# EAGLE schematic WideField_V2 (EAGLE 7.3.0)
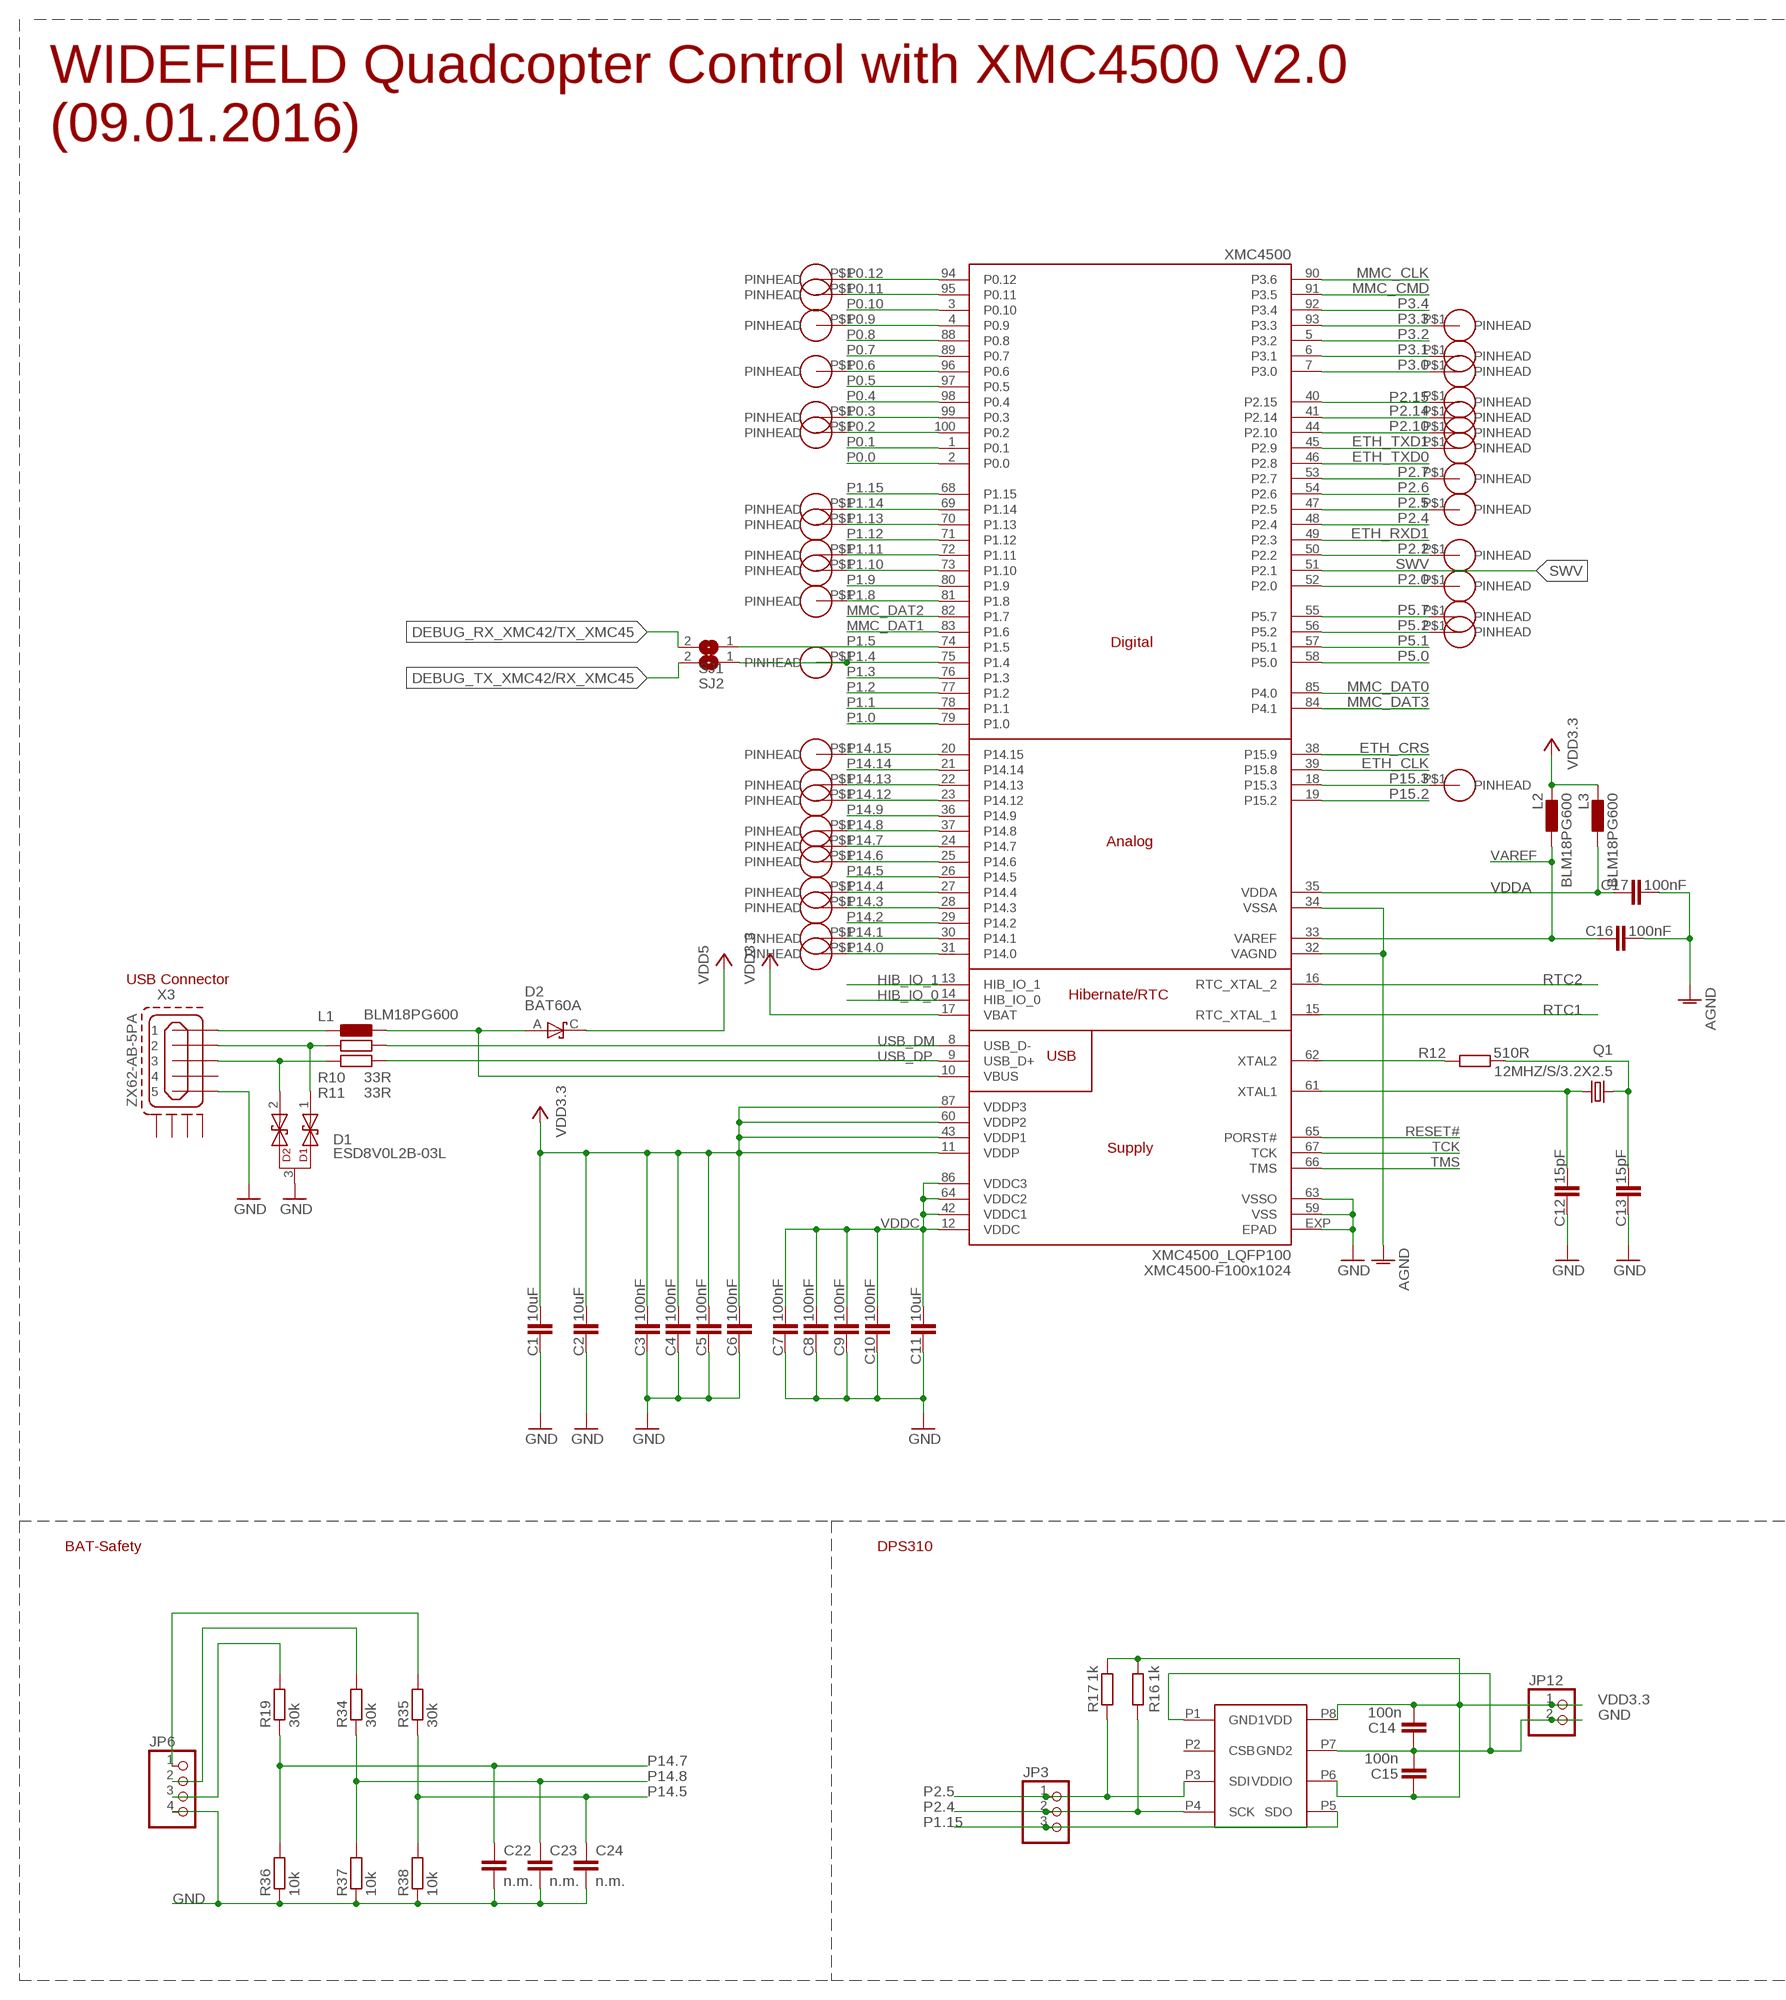
[diagram p0: schematic, sheet 1, part 1 of 2]
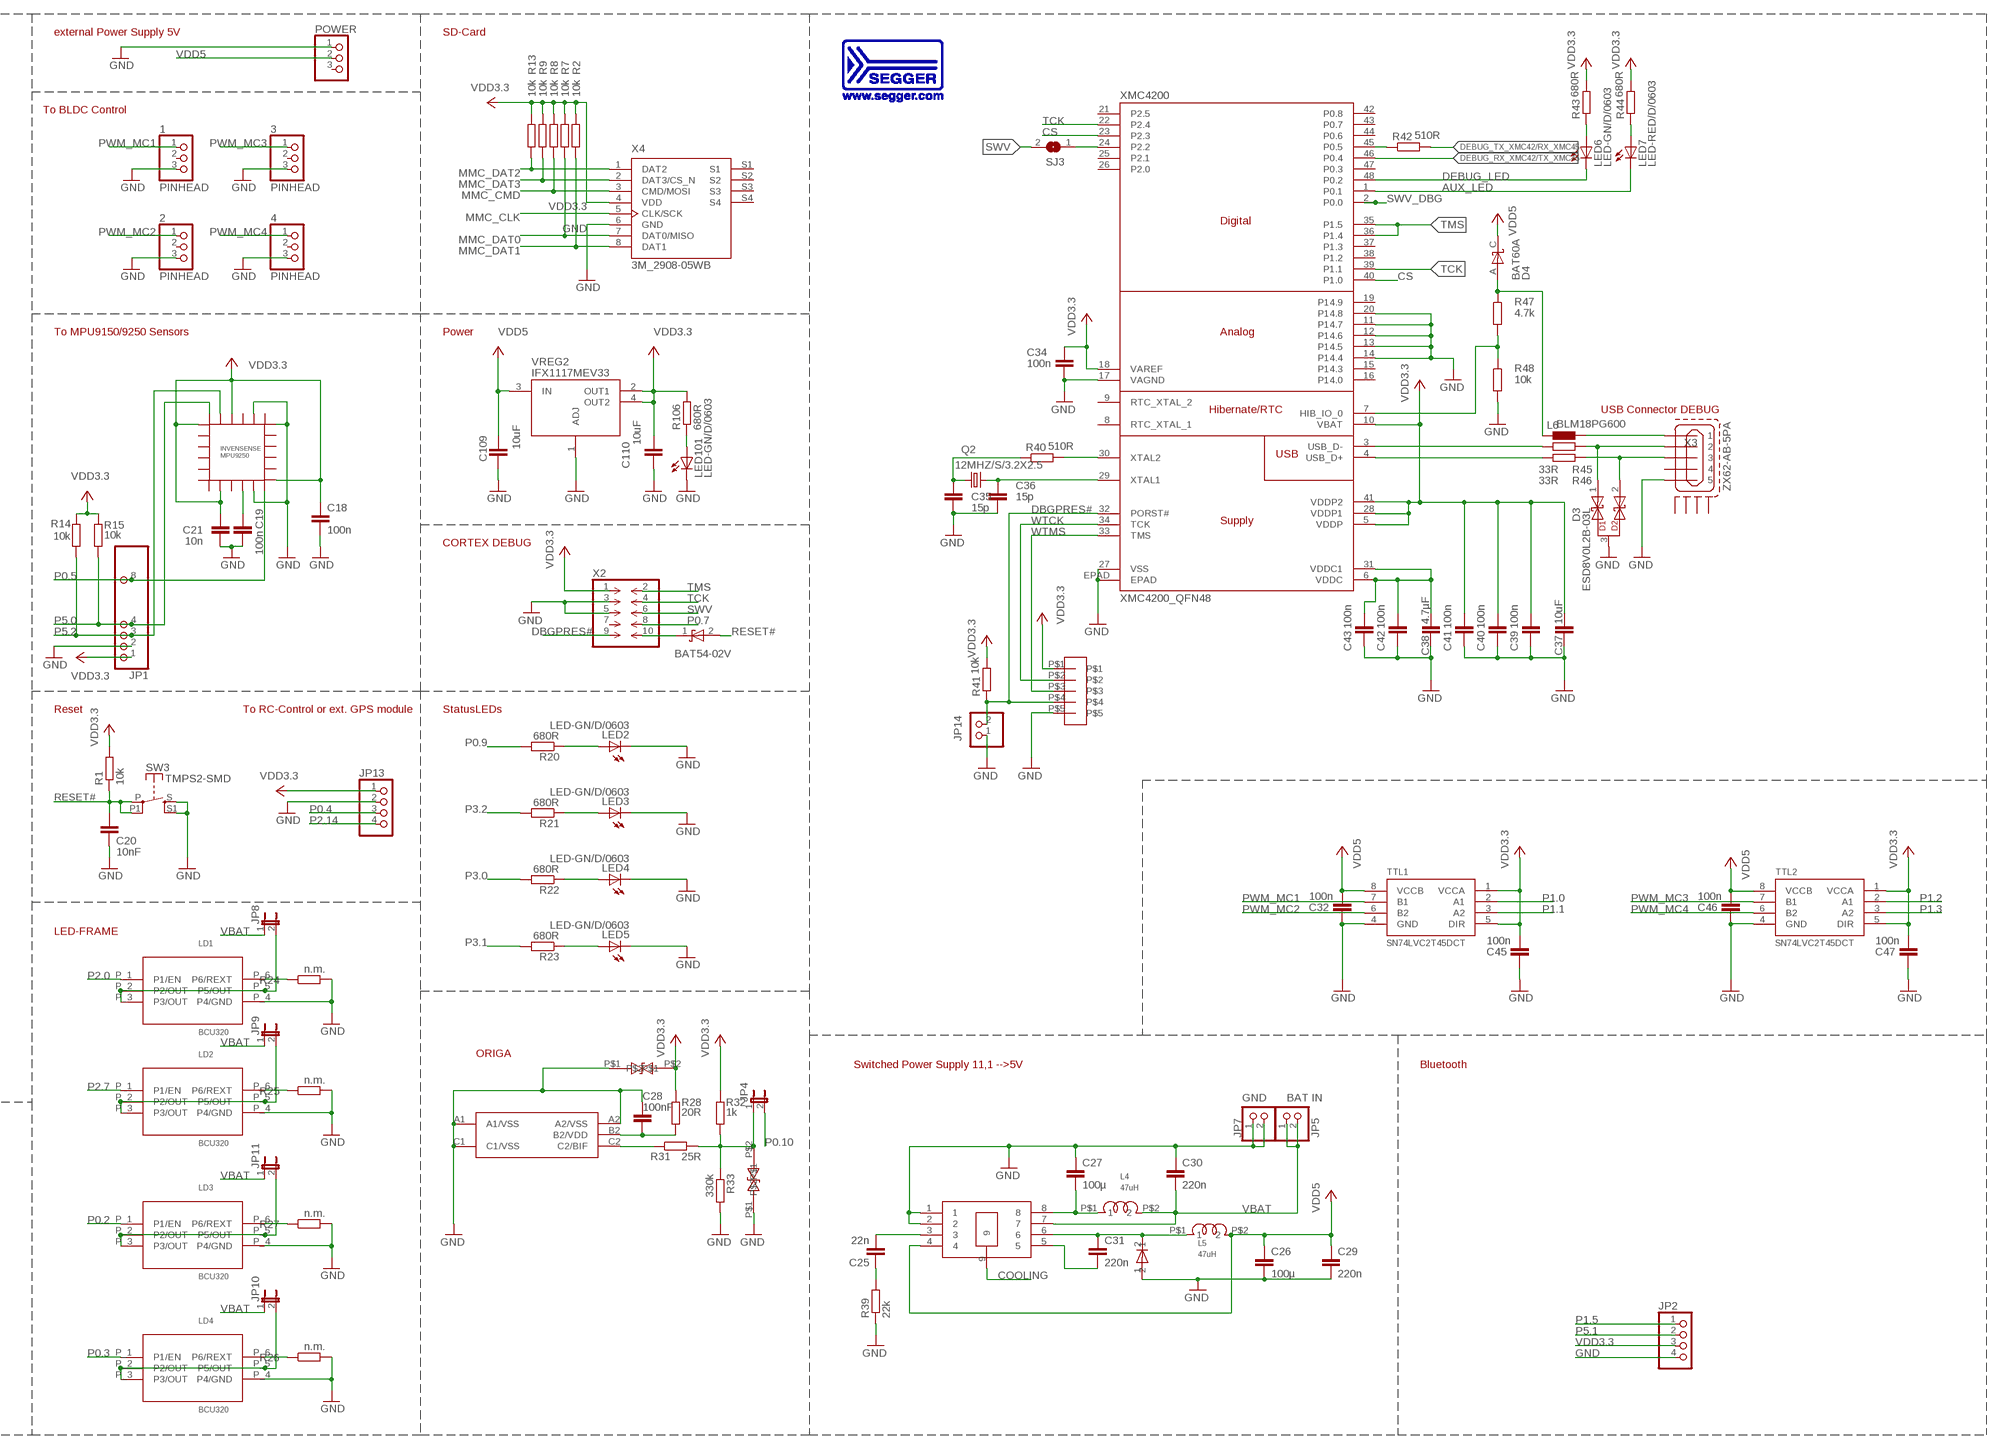
[diagram p1: schematic, sheet 1, part 2 of 2]

## Parts
1  PINHEAD  PINHD-1X3  [1X03]
2  PINHEAD  PINHD-1X3  [1X03]
3  PINHEAD  PINHD-1X3  [1X03]
4  PINHEAD  PINHD-1X3  [1X03]
C1  10uF  C-EUC0805K  [C0805K]
C2  10uF  C-EUC0805K  [C0805K]
C3  100nF  C-EUC0402  [C0402]
C4  100nF  C-EUC0402  [C0402]
C5  100nF  C-EUC0402  [C0402]
C6  100nF  C-EUC0402  [C0402]
C7  100nF  C-EUC0402  [C0402]
C8  100nF  C-EUC0402  [C0402]
C9  100nF  C-EUC0402  [C0402]
C10  100nF  C-EUC0402  [C0402]
C11  10uF  C-EUC0805K  [C0805K]
C12  15pF  C-EUC0402  [C0402]
C13  15pF  C-EUC0402  [C0402]
C14  100n  C-EUC0603  [C0603]
C15  100n  C-EUC0603  [C0603]
C16  100nF  C-EUC0402  [C0402]
C17  100nF  C-EUC0402  [C0402]
C18  100n  C-EUC0603  [C0603]
C19  100n  C-EUC0603  [C0603]
C20  10nF  C-EUC0603  [C0603]
C21  10n  C-EUC0603  [C0603]
C22  n.m.  C-EUC0603K  [C0603K]
C23  n.m.  C-EUC0603K  [C0603K]
C24  n.m.  C-EUC0603K  [C0603K]
C25  22n  C-EUC0603  [C0603]
C26  100µ  C-EUC1210K  [C1210K]
C27  100µ  C-EUC1210K  [C1210K]
C28  100nF  C-EUC0603  [C0603]
C29  220n  C-EUC0603K  [C0603K]
C30  220n  C-EUC0603K  [C0603K]
C31  220n  C-EUC0603K  [C0603K]
C32  100n  C-EUC0603  [C0603]
C34  100n  C-EUC0402  [C0402]
C35  15p  C-EUC0402  [C0402]
C36  15p  C-EUC0402  [C0402]
C37  10uF  C-EUC0805K  [C0805K]
C38  4.7µF  C-EUC0805K  [C0805K]
C39  100n  C-EUC0402  [C0402]
C40  100n  C-EUC0402  [C0402]
C41  100n  C-EUC0402  [C0402]
C42  100n  C-EUC0402  [C0402]
C43  100n  C-EUC0402  [C0402]
C45  100n  C-EUC0603  [C0603]
C46  100n  C-EUC0603  [C0603]
C47  100n  C-EUC0603  [C0603]
C109  10uF  C-EUC0805K  [C0805K]
C110  10uF  C-EUC0805K  [C0805K]
D1  ESD8V0L2B-03L  [TSLP-3-1]
D2  BAT60A  BAT60  [SOD323-R]
D3  ESD8V0L2B-03L  [TSLP-3-1]
D4  BAT60A  BAT60  [SOD323-R]
D5  INF-SOD323_V_1  [INF-SOD323_V_1PRIMARY]
D6  ESD218-B1-02EL  [TSLP-2-20]
D7  ESD218-B1-02EL  [TSLP-2-20]
D8  BAT54-02V  [SC79]
DPS310  DPS310  DPS310DRUCKSENSOR  [LGA8R125P0X4_500X300X120]
JP1  PINHD-1X10  [1X10]
JP2  PINHD-1X4  [1X04]
JP3  PINHD-1X3  [1X03]
JP4  JP1E  [JP1]
JP5  PINHD-1X2  [1X02]
JP6  PINHD-1X4  [1X04]
JP7  PINHD-1X2  [1X02]
JP8  JP1E  [JP1]
JP9  JP1E  [JP1]
JP10  JP1E  [JP1]
JP11  JP1E  [JP1]
JP12  PINHD-1X2  [1X02]
JP13  PINHD-1X4  [1X04]
JP14  PINHD-1X2  [1X02]
L1  BLM18PG600  L_EU_L0603  [L1608]
L2  BLM18PG600  L_EU_L0603  [L1608]
L3  BLM18PG600  L_EU_L0603  [L1608]
L4  47uH  WUERTH47UHIND  [WE-TPC]
L5  47uH  WUERTH47UHIND  [WE-TPC]
L6  BLM18PG600  L_EU_L0603  [L1608]
LD1  BCU320  [SC74]
LD2  BCU320  [SC74]
LD3  BCU320  [SC74]
LD4  BCU320  [SC74]
LED2  LED-GN/D/0603  LEDCHIPLED_0603  [CHIPLED_0603]
LED3  LED-GN/D/0603  LEDCHIPLED_0603  [CHIPLED_0603]
LED4  LED-GN/D/0603  LEDCHIPLED_0603  [CHIPLED_0603]
LED5  LED-GN/D/0603  LEDCHIPLED_0603  [CHIPLED_0603]
LED6  LED-GN/D/0603  LEDCHIPLED_0603  [CHIPLED_0603]
LED7  LED-RED/D/0603  LEDCHIPLED_0603  [CHIPLED_0603]
LED101  LED-GN/D/0603  LEDCHIPLED_0603  [CHIPLED_0603]
MPU9250  9250  INVENSENSE9250IHERBY  [QFN3X3-24+]
ORIGA  n.m.  ORIGA2L  [WLB-5]
POWER  PINHD-1X3  [1X03]
Q1  12MHZ/S/3.2X2.5  NX3225_2  [32X25_4PAD]
Q2  12MHZ/S/3.2X2.5  NX3225_2  [32X25_4PAD]
R1  10k  R-EU_R0603  [R0603]
R2  10k  R-EU_R0402  [R0402]
R7  10k  R-EU_R0402  [R0402]
R8  10k  R-EU_R0402  [R0402]
R9  10k  R-EU_R0402  [R0402]
R10  33R  R-EU_R0402  [R0402]
R11  33R  R-EU_R0402  [R0402]
R12  510R  R-EU_R0603  [R0603]
R13  10k  R-EU_R0402  [R0402]
R14  10k  R-EU_R0603  [R0603]
R15  10k  R-EU_R0603  [R0603]
R16  1k  R-EU_R0603  [R0603]
R17  1k  R-EU_R0603  [R0603]
R19  30k  R-EU_R0603  [R0603]
R20  680R  R-EU_R0603  [R0603]
R21  680R  R-EU_R0603  [R0603]
R22  680R  R-EU_R0603  [R0603]
R23  680R  R-EU_R0603  [R0603]
R24  n.m.  R-EU_R0603  [R0603]
R25  n.m.  R-EU_R0603  [R0603]
R26  n.m.  R-EU_R0603  [R0603]
R27  n.m.  R-EU_R0603  [R0603]
R28  20R  R-EU_R0603  [R0603]
R31  25R  R-EU_R0603  [R0603]
R32  1k  R-EU_R0603  [R0603]
R33  330k  R-EU_R0603  [R0603]
R34  30k  R-EU_R0603  [R0603]
R35  30k  R-EU_R0603  [R0603]
R36  10k  R-EU_R0603  [R0603]
R37  10k  R-EU_R0603  [R0603]
R38  10k  R-EU_R0603  [R0603]
R39  22k  R-EU_R0603  [R0603]
R40  510R  R-EU_R0402  [R0402]
R41  10k  R-EU_R0402  [R0402]
R42  510R  R-EU_R0402  [R0402]
R43  680R  R-EU_R0402  [R0402]
R44  680R  R-EU_R0402  [R0402]
R45  33R  R-EU_R0402  [R0402]
R46  33R  R-EU_R0402  [R0402]
R47  4.7k  R-EU_R0402  [R0402]
R48  10k  R-EU_R0402  [R0402]
R106  680R  R-EU_R0603  [R0603]
SJ1  SJ  [SJ]
SJ2  SJ  [SJ]
SJ3  SJ  [SJ]
SW3  TMPS2-SMD  FSM2JSMA  [FSM2JSMA]
TTL1  SN74LVC2T45DCT  [DCT_R-PDSO-G8]
TTL2  SN74LVC2T45DCT  [DCT_R-PDSO-G8]
U$4  SEGGER.L_100  [LOGO_100]
U$6  PINHEADSMALL1  [PINHEADER_SMALL1]
U$7  PINHEADSMALL1  [PINHEADER_SMALL1]
U$10  PINHEADSMALL1  [PINHEADER_SMALL1]
U$12  n.m.  127MARKED  [PINHEAD_127]
U$25  PINHEADSMALL1  [PINHEADER_SMALL1]
U$26  PINHEADSMALL1  [PINHEADER_SMALL1]
U$27  PINHEADSMALL1  [PINHEADER_SMALL1]
U$28  PINHEADSMALL1  [PINHEADER_SMALL1]
U$29  PINHEADSMALL1  [PINHEADER_SMALL1]
U$30  PINHEADSMALL1  [PINHEADER_SMALL1]
U$31  PINHEADSMALL1  [PINHEADER_SMALL1]
U$35  PINHEADSMALL1  [PINHEADER_SMALL1]
U$36  PINHEADSMALL1  [PINHEADER_SMALL1]
U$37  PINHEADSMALL1  [PINHEADER_SMALL1]
U$38  PINHEADSMALL1  [PINHEADER_SMALL1]
U$40  PINHEADSMALL1  [PINHEADER_SMALL1]
U$41  PINHEADSMALL1  [PINHEADER_SMALL1]
U$42  PINHEADSMALL1  [PINHEADER_SMALL1]
U$44  PINHEADSMALL1  [PINHEADER_SMALL1]
U$45  PINHEADSMALL1  [PINHEADER_SMALL1]
U$47  PINHEADSMALL1  [PINHEADER_SMALL1]
U$48  PINHEADSMALL1  [PINHEADER_SMALL1]
U$49  PINHEADSMALL1  [PINHEADER_SMALL1]
U$52  PINHEADSMALL1  [PINHEADER_SMALL1]
U$53  PINHEADSMALL1  [PINHEADER_SMALL1]
U$55  PINHEADSMALL1  [PINHEADER_SMALL1]
U$57  PINHEADSMALL1  [PINHEADER_SMALL1]
U$59  PINHEADSMALL1  [PINHEADER_SMALL1]
U$60  PINHEADSMALL1  [PINHEADER_SMALL1]
U$62  PINHEADSMALL1  [PINHEADER_SMALL1]
U$63  PINHEADSMALL1  [PINHEADER_SMALL1]
U$65  PINHEADSMALL1  [PINHEADER_SMALL1]
U$67  PINHEADSMALL1  [PINHEADER_SMALL1]
U$68  PINHEADSMALL1  [PINHEADER_SMALL1]
U$71  PINHEADSMALL1  [PINHEADER_SMALL1]
U$74  PINHEADSMALL1  [PINHEADER_SMALL1]
U$76  PINHEADSMALL1  [PINHEADER_SMALL1]
USB1  ZX62-AB-5PA  ZX62-AB-5PA_MICRO-USB  [ZX62-AB-5PA_MICRO-USB]
USB2  ZX62-AB-5PA  ZX62-AB-5PA_MICRO-USB  [ZX62-AB-5PA_MICRO-USB]
VREG1  IFX-91041-V50  INF-PG-DSO-8-27_N_1  [INF-PG-DSO-8-27_N_1PRIMARY]
VREG2  IFX1117MEV33  IFX1117  [SOT223]
X2  FTSH-105-01-F-D-K  [FTSH-105-01-F-D-K]
X4  3M_2908-05WB  [3M_MICRO-SD_SLOT]
XMC4200  XMC4200_QFN48  [QFN-48-7X7]
XMC4500  XMC4500_LQFP100  XMC4400_LQFP100  [P/PG-LQFP-100-11]

## Nets
AGND: C16.2 C17.2 XMC4500.32(VAGND) XMC4500.34(VSSA)
AUX_LED: LED7.C XMC4200.1(P0.1)
COOLING: VREG1.9
CS: XMC4200.23(P2.3) XMC4200.40(P1.0)
DBGPRES#: JP14.2 R41.1 U$12.P$4 X2.9 XMC4200.32(PORST#)
DEBUG_LED: LED6.C XMC4200.48(P0.2)
DEBUG_RX_XMC42/TX_XMC45: SJ1.2 XMC4200.46(P0.4)
DEBUG_TX_XMC42/RX_XMC45: R42.2 SJ2.2
ETH_CLK: XMC4500.39(P15.8)
ETH_CRS: XMC4500.38(P15.9)
ETH_RXD1: XMC4500.49(P2.3)
ETH_TXD0: XMC4500.46(P2.8)
ETH_TXD1: U$30.P$1(PINHEAD) XMC4500.45(P2.9)
GND: 1.3 2.3 3.3 4.3 C1.2 C2.2 C3.2 C4.2 C5.2 C6.2 C7.2 C8.2 C9.2 C10.2 C11.2 C12.2 C13.2 C14.2 C15.1 C18.2 C19.1 C20.2 C21.1 C22.2 C23.2 C24.2 C26.2 C27.1 C28.1 C29.2 C30.1 C32.2 C34.2 C35.2 C36.2 C37.2 C38.2 C39.2 C40.2 C41.2 C42.2 C43.2 C45.2 C46.2 C47.2 C109.2 C110.2 D1.3 D3.3 D5.1 D6.P$1 D7.P$1 DPS310.P1(GND1) DPS310.P7(GND2) JP1.2 JP2.4 JP6.4 JP7.1 JP7.2 JP12.2 JP13.2 JP14.1 LD1.P_4(P4/GND) LD2.P_4(P4/GND) LD3.P_4(P4/GND) LD4.P_4(P4/GND) LED2.C LED3.C LED4.C LED5.C LED101.C MPU9250.11 MPU9250.18 MPU9250.20 ORIGA.A1(A1/VSS) ORIGA.A2(A2/VSS) ORIGA.C1(C1/VSS) POWER.1 R24.2 R25.2 R26.2 R27.2 R33.2 R36.1 R37.1 R38.1 R39.1 R48.2 SW3.S SW3.S1(S) TTL1.4(GND) TTL2.4(GND) U$12.P$5 USB1.5 USB2.5 VREG1.1 VREG1.2 VREG2.1(ADJ) X2.3 X2.5 X4.6(GND) XMC4200.11(P14.7) XMC4200.12(P14.6) XMC4200.13(P14.5) XMC4200.14(P14.4) XMC4200.17(VAGND) XMC4200.20(P14.8) XMC4200.27(VSS) XMC4200.EPAD XMC4500.59(VSS) XMC4500.63(VSSO) XMC4500.EXP(EPAD)
HIB_IO_0: XMC4500.14(HIB_IO_0)
HIB_IO_1: XMC4500.13(HIB_IO_1)
MMC_CLK: X4.5(CLK/SCK) XMC4500.90(P3.6)
MMC_CMD: R8.1 X4.3(CMD/MOSI) XMC4500.91(P3.5)
MMC_DAT0: R7.1 X4.7(DAT0/MISO) XMC4500.85(P4.0)
MMC_DAT1: R2.1 X4.8(DAT1) XMC4500.83(P1.6)
MMC_DAT2: R13.1 X4.1(DAT2) XMC4500.82(P1.7)
MMC_DAT3: R9.1 X4.2(DAT3/CS_N) XMC4500.84(P4.1)
N$1: LED2.A R20.1
N$2: C38.1 C42.1 C43.1 XMC4200.6(VDDC) XMC4200.31(VDDC1)
N$3: LED3.A R21.1
N$4: LED6.A R43.1
N$5: LED7.A R44.1
N$6: R12.1 XMC4500.62(XTAL2)
N$7: C13.1 Q1.3 R12.2
N$8: C12.1 Q1.1 XMC4500.61(XTAL1)
N$9: JP6.1 R35.2
N$10: C35.1 Q2.1 R40.1
N$11: L1.2 USB1.1
N$12: C25.2 VREG1.3
N$13: D1.1 R10.1 USB1.2
N$15: C25.1 R39.2
N$16: LED101.A R106.1
N$17: C27.2 L4.P$1 VREG1.8
N$19: C28.2 ORIGA.B2(B2/VDD) R28.2
N$21: JP6.2 R34.2
N$22: LED4.A R22.1
N$23: D2.A L1.1 XMC4500.10(VBUS)
N$24: LED5.A R23.1
N$25: ORIGA.C2(C2/BIF) R31.1
N$26: LD1.P_6(P6/REXT) R24.1
N$27: D6.P$2 JP4.1 R31.2 R32.2 R33.1
N$28: JP8.2 LD1.P_2(P2/OUT) LD1.P_3(P3/OUT) LD1.P_5(P5/OUT)
N$29: LD2.P_6(P6/REXT) R25.1
N$30: JP9.2 LD2.P_2(P2/OUT) LD2.P_3(P3/OUT) LD2.P_5(P5/OUT)
N$31: LD4.P_6(P6/REXT) R26.1
N$32: JP10.2 LD4.P_2(P2/OUT) LD4.P_3(P3/OUT) LD4.P_5(P5/OUT)
N$33: LD3.P_6(P6/REXT) R27.1
N$34: JP11.2 LD3.P_2(P2/OUT) LD3.P_3(P3/OUT) LD3.P_5(P5/OUT)
N$35: JP6.3 R19.2
N$36: D1.2 R11.1 USB1.3
N$37: C31.2 VREG1.5
N$38: L6.2 USB2.1
N$39: C31.1 D5.2 L5.P$1 VREG1.6
N$40: R40.2 XMC4200.30(XTAL2)
N$41: C36.1 Q2.3 XMC4200.29(XTAL1)
N$42: C19.2 MPU9250.10
N$44: D8.1(C) X2.10
N$47: D3.1 R45.1 USB2.2
N$48: D3.2 R46.1 USB2.3
N$49: D4.A L6.1 R47.1
N$50: R42.1 XMC4200.45(P0.5)
N$52: R47.2 R48.1 XMC4200.7(HIB_IO_0)
P0.0: XMC4500.2(P0.0)
P0.1: XMC4500.1(P0.1)
P0.2: LD3.P_1(P1/EN) U$67.P$1(PINHEAD) XMC4500.100(P0.2)
P0.3: LD4.P_1(P1/EN) U$68.P$1(PINHEAD) XMC4500.99(P0.3)
P0.4: JP13.3 XMC4500.98(P0.4)
P0.5: JP1.8 MPU9250.12 XMC4500.97(P0.5)
P0.6: U$71.P$1(PINHEAD) XMC4500.96(P0.6)
P0.7: X2.8 XMC4500.89(P0.7)
P0.8: XMC4500.88(P0.8)
P0.9: R20.2 U$74.P$1(PINHEAD) XMC4500.4(P0.9)
P0.10: JP4.2 XMC4500.3(P0.10)
P0.11: U$76.P$1(PINHEAD) XMC4500.95(P0.11)
P0.12: U$7.P$1(PINHEAD) XMC4500.94(P0.12)
P1.0: TTL1.2(A1) XMC4500.79(P1.0)
P1.1: TTL1.3(A2) XMC4500.78(P1.1)
P1.2: TTL2.2(A1) XMC4500.77(P1.2)
P1.3: TTL2.3(A2) XMC4500.76(P1.3)
P1.4: SJ2.1 U$40.P$1(PINHEAD) XMC4500.75(P1.4)
P1.5: JP2.1 SJ1.1 XMC4500.74(P1.5)
P1.8: U$57.P$1(PINHEAD) XMC4500.81(P1.8)
P1.9: XMC4500.80(P1.9)
P1.10: U$59.P$1(PINHEAD) XMC4500.73(P1.10)
P1.11: U$60.P$1(PINHEAD) XMC4500.72(P1.11)
P1.12: XMC4500.71(P1.12)
P1.13: U$62.P$1(PINHEAD) XMC4500.70(P1.13)
P1.14: U$63.P$1(PINHEAD) XMC4500.69(P1.14)
P1.15: DPS310.P5(SDO) JP3.3 XMC4500.68(P1.15)
P2.0: LD1.P_1(P1/EN) U$35.P$1(PINHEAD) XMC4500.52(P2.0)
P2.2: U$65.P$1(PINHEAD) XMC4500.50(P2.2)
P2.4: DPS310.P4(SCK) JP3.2 R16.2 XMC4500.48(P2.4)
P2.5: DPS310.P3(SDI) JP3.1 R17.2 U$31.P$1(PINHEAD) XMC4500.47(P2.5)
P2.6: XMC4500.54(P2.6)
P2.7: LD2.P_1(P1/EN) U$29.P$1(PINHEAD) XMC4500.53(P2.7)
P2.10: U$28.P$1(PINHEAD) XMC4500.44(P2.10)
P2.14: JP13.4 U$27.P$1(PINHEAD) XMC4500.41(P2.14)
P2.15: U$26.P$1(PINHEAD) XMC4500.40(P2.15)
P3.0: R22.2 U$25.P$1(PINHEAD) XMC4500.7(P3.0)
P3.1: R23.2 U$10.P$1(PINHEAD) XMC4500.6(P3.1)
P3.2: R21.2 XMC4500.5(P3.2)
P3.3: U$6.P$1(PINHEAD) XMC4500.93(P3.3)
P3.4: XMC4500.92(P3.4)
P5.0: JP1.4 MPU9250.24 R15.1 XMC4500.58(P5.0)
P5.1: JP2.2 XMC4500.57(P5.1)
P5.2: JP1.3 MPU9250.23 R14.1 U$37.P$1(PINHEAD) XMC4500.56(P5.2)
P5.7: U$36.P$1(PINHEAD) XMC4500.55(P5.7)
P14.0: U$41.P$1(PINHEAD) XMC4500.31(P14.0)
P14.1: U$42.P$1(PINHEAD) XMC4500.30(P14.1)
P14.2: XMC4500.29(P14.2)
P14.3: U$44.P$1(PINHEAD) XMC4500.28(P14.3)
P14.4: U$45.P$1(PINHEAD) XMC4500.27(P14.4)
P14.5: C24.1 R35.1 R38.2 XMC4500.26(P14.5)
P14.6: U$47.P$1(PINHEAD) XMC4500.25(P14.6)
P14.7: C22.1 R19.1 R36.2 U$48.P$1(PINHEAD) XMC4500.24(P14.7)
P14.8: C23.1 R34.1 R37.2 U$49.P$1(PINHEAD) XMC4500.37(P14.8)
P14.9: XMC4500.36(P14.9)
P14.12: U$52.P$1(PINHEAD) XMC4500.23(P14.12)
P14.13: U$53.P$1(PINHEAD) XMC4500.22(P14.13)
P14.14: XMC4500.21(P14.14)
P14.15: U$55.P$1(PINHEAD) XMC4500.20(P14.15)
P15.2: XMC4500.19(P15.2)
P15.3: U$38.P$1(PINHEAD) XMC4500.18(P15.3)
PWM_MC1: 1.1 TTL1.7(B1)
PWM_MC2: 2.1 TTL1.6(B2)
PWM_MC3: 3.1 TTL2.7(B1)
PWM_MC4: 4.1 TTL2.6(B2)
RESET#: C20.1 D8.2(A) R1.1 SW3.P SW3.P1(P) XMC4500.65(PORST#)
RTC1: XMC4500.15(RTC_XTAL_1)
RTC2: XMC4500.16(RTC_XTAL_2)
SWV: SJ3.2 X2.6 XMC4500.51(P2.1)
SWV_DBG: SJ3.1 XMC4200.2(P0.0) XMC4200.24(P2.2)
TCK: X2.4 XMC4200.22(P2.4) XMC4200.39(P1.1) XMC4500.67(TCK)
TMS: X2.2 XMC4200.35(P1.5) XMC4200.36(P1.4) XMC4500.66(TMS)
USB_DM: R10.2 XMC4500.8(USB_D-)
USB_DM1: R45.2 XMC4200.3(USB_D-)
USB_DP: R11.2 XMC4500.9(USB_D+)
USB_DP1: R46.2 XMC4200.4(USB_D+)
VAREF: C16.1 L2.1 XMC4500.33(VAREF)
VBAT: C30.2 JP5.1 JP5.2 JP8.1 JP9.1 JP10.1 JP11.1 L4.P$2 VREG1.7
VDD3.3: C1.1 C2.1 C3.1 C4.1 C5.1 C6.1 C14.1 C15.2 C18.1 C21.2 C34.1 C37.1 C39.1 C40.1 C41.1 C45.1 C47.1 C110.1 D7.P$2 DPS310.P6(VDDIO) DPS310.P8(VDD) JP1.1 JP2.3 JP12.1 JP13.1 L2.2 L3.2 MPU9250.1 MPU9250.8 MPU9250.13 MPU9250.22 R1.2 R2.2 R7.2 R8.2 R9.2 R13.2 R14.2 R15.2 R16.1 R17.1 R28.1 R32.1 R41.2 R43.2 R44.2 R106.2 TTL1.1(VCCA) TTL1.5(DIR) TTL2.1(VCCA) TTL2.5(DIR) U$12.P$1 VREG2.2(OUT1) VREG2.4(OUT2) X2.1 X4.4(VDD) XMC4200.5(VDDP) XMC4200.10(VBAT) XMC4200.18(VAREF) XMC4200.28(VDDP1) XMC4200.41(VDDP2) XMC4500.11(VDDP) XMC4500.17(VBAT) XMC4500.43(VDDP1) XMC4500.60(VDDP2) XMC4500.87(VDDP3)
VDD5: C26.1 C29.1 C32.1 C46.1 C109.1 D2.C D4.C L5.P$2 POWER.2 TTL1.8(VCCB) TTL2.8(VCCB) VREG1.4 VREG2.3(IN)
VDDA: C17.1 L3.1 XMC4500.35(VDDA)
VDDC: C7.1 C8.1 C9.1 C10.1 C11.1 XMC4500.12(VDDC) XMC4500.42(VDDC1) XMC4500.64(VDDC2) XMC4500.86(VDDC3)
WTCK: U$12.P$2 XMC4200.34(TCK)
WTMS: U$12.P$3 XMC4200.33(TMS)
Unconnected: 1.2 2.2 3.2 4.2 DPS310.P2(CSB) MPU9250.2 MPU9250.3 MPU9250.4 MPU9250.5 MPU9250.6 MPU9250.7 MPU9250.9 MPU9250.14 MPU9250.15 MPU9250.16 MPU9250.17 MPU9250.19 MPU9250.21 POWER.3 USB1.4 USB1.S1(S:S1) USB1.S2(S:S2) USB1.S3(S:S3) USB1.S4(S:S4) USB2.4 USB2.S1(S:S1) USB2.S2(S:S2) USB2.S3(S:S3) USB2.S4(S:S4) X2.7 X4.S1 X4.S2 X4.S3 X4.S4 XMC4200.8(RTC_XTAL_1) XMC4200.9(RTC_XTAL_2) XMC4200.15(P14.3) XMC4200.16(P14.0) XMC4200.19(P14.9) XMC4200.21(P2.5) XMC4200.25(P2.1) XMC4200.26(P2.0) XMC4200.37(P1.3) XMC4200.38(P1.2) XMC4200.42(P0.8) XMC4200.43(P0.7) XMC4200.44(P0.6) XMC4200.47(P0.3)

## Notes on the sheet
- external Power Supply 5V | SD-Card
- WIDEFIELD Quadcopter Control with XMC4500 V2.0
  (09.01.2016)
- To BLDC Control
- To MPU9150/9250 Sensors | Power
- USB Connector DEBUG
- X3
- CORTEX DEBUG
- USB Connector | Reset | To RC-Control or ext. GPS module | StatusLEDs
- X3
- XMC4500-F100x1024
- LED-FRAME
- ORIGA
- Switched Power Supply 11,1 -->5V | Bluetooth
- GND | BAT IN
- BAT-Safety | DPS310

## Library data of the parts
1-4 JP3 POWER = pinhead:PINHD-1X3: PIN HEADER
C1 C2 C11 C38 C109 C110 = libHMI_OLED-V1:C-EU: CAPACITOR, European symbol
C3-C10 C12 C13 C16 C17 C34-C36 C39-C43 = libDsC:C-EUC0402
C14 C15 C18-C32 C37 C45-C47 = libresistor:C-EU: CAPACITOR, European symbol
D1 D3 = libDsDiod:ESD8V0L2B-03L
D2 D4 = libDsDiod:BAT60
D5 = libBAS21-03W_INF-SOD323V:INF-SOD323_V_1
D6 D7 = libESD218-B1:ESD218-B1-02EL
D8 = DsDiod:BAT54-02V
DPS310 = libdrucksensorDPS310:DPS310DRUCKSENSOR
JP1 = pinhead:PINHD-1X10: PIN HEADER
JP2 JP6 JP13 = pinhead:PINHD-1X4: PIN HEADER
JP4 JP8-JP11 = jumper:JP1E: JUMPER
JP5 JP7 JP12 JP14 = pinhead:PINHD-1X2: PIN HEADER
L1-L3 L6 = libPDFerr:L_EU_
L4 L5 = lib47µHWuerthChoke:WUERTH47UHIND
LD1-LD4 = libLEDtreiber BCR320U:BCU320
LED2-LED7 LED101 = libled:LED: LED OSRAM: - CHIPLED LG R971, LG N971, LY N971, LG Q971, LY Q971, LO R971, LY R971 LH N974, LH R974 LS Q976, LO Q976, LY Q976 LO Q996 - Hyper CHIPLED LW Q18S LB Q993, LB Q99A, LB R99A - SideLED LS A670, LO A670, LY A670, LG A670, LP A670 LB A673, LV A673, LT A673, LW A673 LH A674 LY A675 LS A676, LA A676, LO A676, LY A676, LW A676 LS A679, LY A679, LG A679 - Hyper Micro SIDELED® LS Y876, LA Y876, LO Y876, LY Y876 LT Y87S - SmartLED LW L88C, LW L88S LB L89C, LB L89S, LG L890 LS L89K, LO L89K, LY L89K LS L896, LA L896, LO L896, LY L896 - TOPLED LS T670, LO T670, LY T670, LG T670, LP T670 LSG T670, LSP T670, LSY T670, LOP T670, LYG T670 LG T671, LOG T671, LSG T671 LB T673, LV T673, LT T673, LW T673 LH T674 LS T676, LA T676, LO T676, LY T676, LB T676, LH T676, LSB T676, LW T676 LB T67C, LV T67C, LT T67C, LS T67K, LO T67K, LY T67K, LW E67C LS E67B, LA E67B, LO E67B, LY E67B, LB E67C, LV E67C, LT E67C LW T67C LS T679, LY T679, LG T679 LS T770, LO T770, LY T770, LG T770, LP T770 LB T773, LV T773, LT T773, LW T773 LH T774 LS E675, LA E675, LY E675, LS T675 LS T776, LA T776, LO T776, LY T776, LB T776 LHGB T686 LT T68C, LB T68C - Hyper Mini TOPLED® LB M676 - Mini TOPLED Santana® LG M470 LS M47K, LO M47K, LY M47K Source: http://www.osram.convergy.de/
MPU9250 = libinvensense9250:INVENSENSE9250: Herbys Model of a invensense 9250
ORIGA = libORIGA:ORIGA2L
Q1 Q2 = Quarz:NX3225_2
R1 R14-R17 R19 R24-R27 R34-R39 = libresistor:R-EU_: RESISTOR, European symbol
R2 R7-R11 R13 R40-R48 = libDsR:R-EU_R0402
R12 R20-R23 R28 R31-R33 R106 = libDsR:R-EU_R0603
SJ1-SJ3 = jumper:SJ: SMD solder JUMPER
SW3 = MSwitch:FSM2JSMA
TTL1 TTL2 = libLEVELSHIFTER_SN74LVCxT45:SN74LVC2T45
U$4 = libBOOTKIT1100SEGGER_logo:SEGGER
U$6 U$7 U$10 U$25-U$31 U$35-U$38 U$40-U$42 U$44 U$45 U$47-U$49 U$52 U$53 U$55 U$57 U$59 U$60 U$62 U$63 U$65 U$67 U$68 U$71 U$74 U$76 = pinhead_small1:PINHEADSMALL1
U$12 = libpinhead_127_marked:127MARKED
USB1 USB2 = XSRRND:ZX62-AB-5PA_MICRO-USB
VREG1 = libInfineon-DCDC-91041 - DSO-8:INF-PG-DSO-8-27_N_1
VREG2 = libXMC4500_Relax-V1+USBvertical:IFX1117
X2 = Xtv127:FTSH-105-01-F-D-K
X4 = HMI_OLED-V1:3M_2908-05WB
XMC4200 = libXMC4000_v4.16:XMC4200_QFN48
XMC4500 = libXMC4500_Relax-V1+USBvertical:XMC4400_LQFP100